# Altium schematic sheet Sheet1.SchDoc
size A4
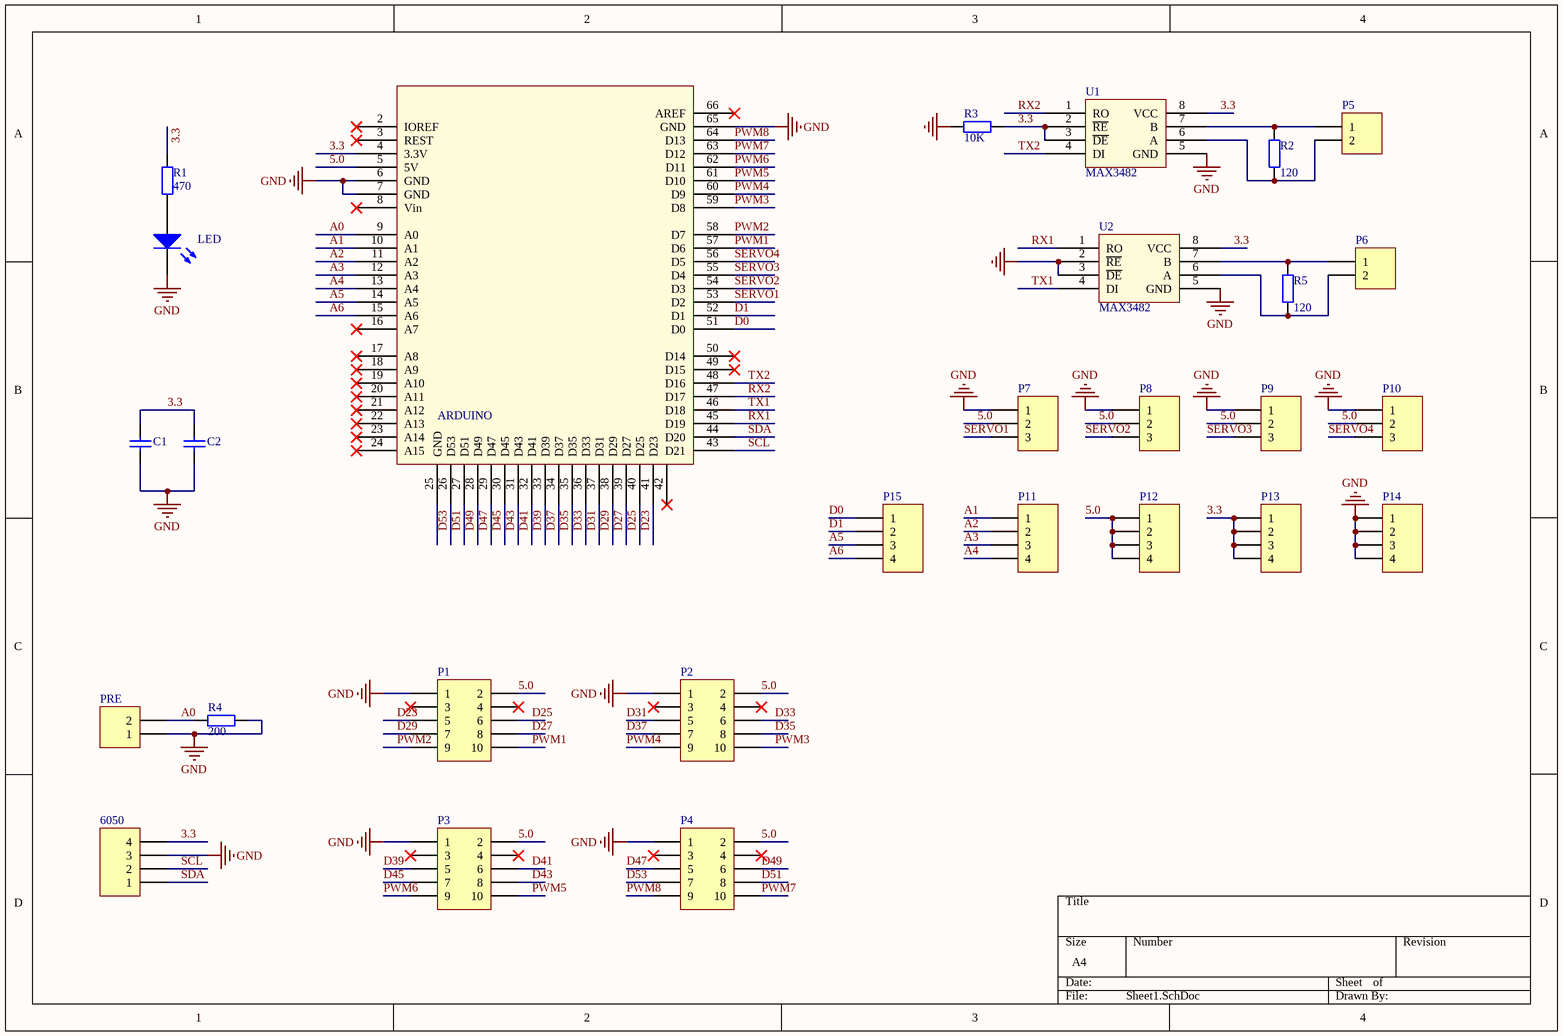
[diagram p0: Sheet1.SchDoc]

## Parts
6050  Header 4  [HDR1X4]  (value not drawn)
ARDUINO  2560  [ARDUINO]  (value not drawn)
C1  Cap  [0805]  (value not drawn)
C2  Cap  [0805]  (value not drawn)
LED  LED0  [0805]  (value not drawn)
P1  Header 5X2  [HDR2X5]  (value not drawn)
P2  Header 5X2  [HDR2X5]  (value not drawn)
P3  Header 5X2  [HDR2X5]  (value not drawn)
P4  Header 5X2  [HDR2X5]  (value not drawn)
P5  Header 2  [蓝色电源插座]  (value not drawn)
P6  Header 2  [蓝色电源插座]  (value not drawn)
P7  Header 3  [HDR1X3]  (value not drawn)
P8  Header 3  [HDR1X3]  (value not drawn)
P9  Header 3  [HDR1X3]  (value not drawn)
P10  Header 3  [HDR1X3]  (value not drawn)
P11  Header 4  [HDR1X4]  (value not drawn)
P12  Header 4  [HDR1X4]  (value not drawn)
P13  Header 4  [HDR1X4]  (value not drawn)
P14  Header 4  [HDR1X4]  (value not drawn)
P15  Header 4  [HDR1X4]  (value not drawn)
PRE  Header 2  [HDR1X2]  (value not drawn)
R1  value 470  [0805]  (hidden comment: Res2)
R2  value 120  [0805]  (hidden comment: Res2)
R3  value 10K  [0805]  (hidden comment: Res2)
R4  value 200  [0805]  (hidden comment: Res2)
R5  value 120  [0805]  (hidden comment: Res2)
U1  MAX3482  [3485]
U2  MAX3482  [3485]

## Nets
GND: 6050.3 ARDUINO.6(GND) ARDUINO.7(GND) ARDUINO.65(GND) C1.1 C2.1 LED.2(K) P1.1 P2.1 P3.1 P4.1 P7.1 P8.1 P9.1 P10.1 P14.1 P14.2 P14.3 P14.4 PRE.1 R3.2 R4.2 U1.5(GND) U2.2(~{RE}) U2.3(~{DE}) U2.5(GND)
3.3: 6050.4 ARDUINO.4(3.3V) C1.2 C2.2 P13.1 P13.2 P13.3 P13.4 R1.1 R3.1 U1.2(~{RE}) U1.3(~{DE}) U1.8(VCC) U2.8(VCC)
5.0: ARDUINO.5(5V) P1.2 P2.2 P3.2 P4.2 P7.2 P8.2 P9.2 P10.2 P12.1 P12.2 P12.3 P12.4
A0: ARDUINO.9(A0) PRE.2 R4.1
A1: ARDUINO.10(A1) P11.1
A2: ARDUINO.11(A2) P11.2
A3: ARDUINO.12(A3) P11.3
A4: ARDUINO.13(A4) P11.4
A5: ARDUINO.14(A5) P15.3
A6: ARDUINO.15(A6) P15.4
D0: ARDUINO.51(D0) P15.1
D1: ARDUINO.52(D1) P15.2
D23: ARDUINO.41(D23) P1.5
D25: ARDUINO.40(D25) P1.6
D27: ARDUINO.39(D27) P1.8
D29: ARDUINO.38(D29) P1.7
D31: ARDUINO.37(D31) P2.5
D33: ARDUINO.36(D33) P2.6
D35: ARDUINO.35(D35) P2.8
D37: ARDUINO.34(D37) P2.7
D39: ARDUINO.33(D39) P3.5
D41: ARDUINO.32(D41) P3.6
D43: ARDUINO.31(D43) P3.8
D45: ARDUINO.30(D45) P3.7
D47: ARDUINO.29(D47) P4.5
D49: ARDUINO.28(D49) P4.6
D51: ARDUINO.27(D51) P4.8
D53: ARDUINO.26(D53) P4.7
PWM1: ARDUINO.57(D6) P1.10
PWM2: ARDUINO.58(D7) P1.9
PWM3: ARDUINO.59(D8) P2.10
PWM4: ARDUINO.60(D9) P2.9
PWM5: ARDUINO.61(D10) P3.10
PWM6: ARDUINO.62(D11) P3.9
PWM7: ARDUINO.63(D12) P4.10
PWM8: ARDUINO.64(D13) P4.9
RX1: ARDUINO.45(D19) U2.1(RO)
RX2: ARDUINO.47(D17) U1.1(RO)
SCL: 6050.2 ARDUINO.43(D21)
SDA: 6050.1 ARDUINO.44(D20)
SERVO1: ARDUINO.53(D2) P7.3
SERVO2: ARDUINO.54(D3) P8.3
SERVO3: ARDUINO.55(D4) P9.3
SERVO4: ARDUINO.56(D5) P10.3
TX1: ARDUINO.46(D18) U2.4(DI)
TX2: ARDUINO.48(D16) U1.4(DI)
NetLED_1: LED.1(A) R1.2
NetP5_1: P5.1(2) R2.1 U1.6(A)
NetP5_2: P5.2(1) R2.2 U1.7(B)
NetP6_1: P6.1(2) R5.1 U2.6(A)
NetP6_2: P6.2(1) R5.2 U2.7(B)

Not connected (* = marked no-connect by the designer): ARDUINO 2(IOREF)* 3(REST)* 8(Vin)* 16(A7)* 17(A8)* 18(A9)* 19(A10)* 20(A11)* 21(A12)* 22(A13)* 23(A14)* 24(A15)* 25(GND) 42* 49(D15)* 50(D14)* 66(AREF)*; P1 3* 4*; P2 3* 4*; P3 3* 4*; P4 3* 4*

## Library data of the parts
6050 P11-P15 = Header 4: Header, 4-Pin; LatestRevisionDate: 17-Jul-2002; LatestRevisionNote: Re-released for DXP Platform.; Publisher: Altium Limited
ARDUINO = Component_1
C1 C2 = Cap: Capacitor; Value: 100pF; Published: 8-Jun-2000; LatestRevisionDate: 17-Jul-2002; LatestRevisionNote: Re-released for DXP Platform.; PackageReference: RAD-0.3; Publisher: Altium Limited
LED = LED0: Typical INFRARED GaAs LED; Published: 8-Jun-2000; LatestRevisionDate: 08-Jul-2005; LatestRevisionNote: Mech Layer 1 removed.; PackageReference: LED-0; Publisher: Altium Limited
P1-P4 = Header 5X2: Header, 5-Pin, Dual row; LatestRevisionDate: 17-Jul-2002; LatestRevisionNote: Re-released for DXP Platform.; Publisher: Altium Limited
P5 P6 PRE = Header 2: Header, 2-Pin; LatestRevisionDate: 17-Jul-2002; LatestRevisionNote: Re-released for DXP Platform.; Publisher: Altium Limited
P7-P10 = Header 3: Header, 3-Pin; LatestRevisionDate: 17-Jul-2002; LatestRevisionNote: Re-released for DXP Platform.; Publisher: Altium Limited
R1-R5 = Res2: Resistor; Published: 8-Jun-2000; LatestRevisionDate: 17-Jul-2002; LatestRevisionNote: Re-released for DXP Platform.; PackageReference: AXIAL-0.4; Publisher: Altium Limited